# Altium schematic sheet CAN_Tranceiver.SchDoc
size A
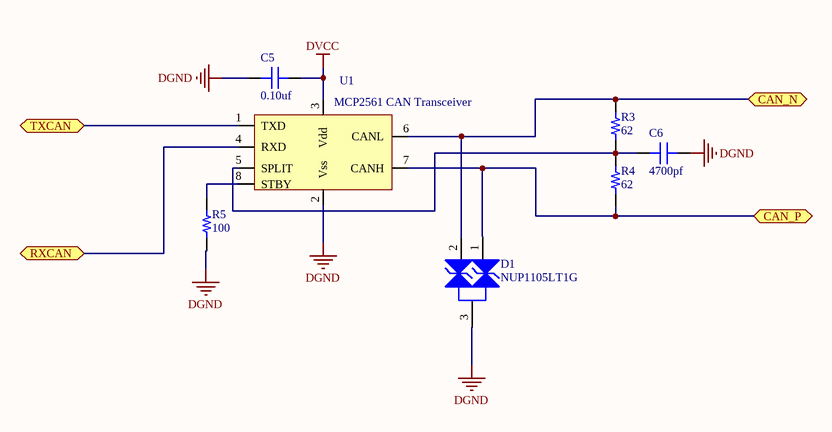
[diagram p0: CAN_Tranceiver.SchDoc]

## Parts
C5  value 0.10uf  [CAP 0603/1608]  (hidden comment: Capacitor MLCC 0.10uf 50V CAP 0603/1608)
C6  value 4700pf  [CAP 0603/1608]  (hidden comment: Capacitor MLCC 4700pf 50V CAP 0603/1608)
D1  NUP1105LT1G  [SOT-23 (TO-236)]
R3  value 62  [RES 0603/1608]  (hidden comment: Resistor 62 0603 1/10W 5%)
R4  value 62  [RES 0603/1608]  (hidden comment: Resistor 62 0603 1/10W 5%)
R5  value 100  [RES 0603/1608]  (hidden comment: Resistor 100 0603 1/10W 10%)
U1  MCP2561 CAN Transceiver  [SOIC-8]

## Ports
CAN_N (bidir), CAN_P (bidir), RXCAN (bidir), TXCAN (bidir)

## Nets
DGND: C5.1 C6.1 D1.3(K) R5.1 U1.2(Vss)
DVCC: C5.2 U1.3(Vdd)
CAN_N: D1.2(K) R3.1 U1.6(CANL) ; port CAN_N
CAN_P: D1.1(K) R4.2 U1.7(CANH) ; port CAN_P
RXCAN: U1.4(RXD) ; port RXCAN
TXCAN: U1.1(TXD) ; port TXCAN
NetC6_2: C6.2 R3.2 R4.1 U1.5(SPLIT)
NetR5_2: R5.2 U1.8(STBY)

## Library data of the parts
C5 = 943: Manufacturer_id: 1; idCapacitor: 943; Name: Cap_0.10uf_50V_CAP 0603/1608; Dielectric: Ceramic; Created_By: Nick Mah; Drawer_id: 1; Voltage_Rating: 50V; Package: CAP 0603/1608; Created_Date: 10/20/2018
C6 = 929: Manufacturer_id: 1; idCapacitor: 929; Name: Cap_4700pf_50V_CAP 0603/1608; Dielectric: Ceramic; Created_By: Nick Mah; Drawer_id: 1; Voltage_Rating: 50V; Package: CAP 0603/1608; Created_Date: 10/20/2018
D1 = 7: ESD Protection Diode; Manufacturer_id: 1; idDiode: 7; Name: SOT-23_350W_Zener; Value: TVS_24V; Type: Zener; Ic: 8A; Power: 350W; Drawer_id: 1; Num_Circuits: 1; Package: SOT-23; MfrPartNo: NUP1105LT1G; Link: https://www.digikey.com/product-detail/en/on-semiconductor/NUP1105LT1G/NUP1105LT1GOSCT-ND/2122067; ComponentLink1URL: https://www.digikey.com/product-detail/en/on-semiconductor/NUP1105LT1G/NUP1105LT1GOSCT-ND/2122067; Supplier1: Digikey; Supplier1PartNo: NUP1105LT1GOSCT-ND
R3 R4 = 1340: Manufacturer_id: 1; idResistor: 1340; Name: Res_62_0603_1/10W_5%; Created_By: Nick Mah; Supplier 1: Digi-Key; Drawer_id: 1; Tolerance: 5%; Power: 1/10W; Package: 0603; ComponentLink1Description: Datasheet; Created_Date: 2018-10-20
R5 = 2293: Manufacturer_id: 1; idResistor: 2293; Name: Res_100_0603_1/10W_10%; Created_By: Nick Mah; Supplier 1: Digi-Key; Drawer_id: 1; Tolerance: 10%; Power: 1/10W; Package: 0603; ComponentLink1Description: Datasheet; Created_Date: 2018-10-20
U1 = 5: Manufacturer_id: 1; idIC_Interface: 5; Value: CAN/UART; Data_Rate: 1Mbps; Vin(Min): 4.5V; Vin(Max): 5.5V; Created_By: Angel Delgado; Drawer_id: 1; Name: CAN Transceiver; Type: Transceiver; Protocol: CAN; Num_Circuits: 1; Package: SOIC-8; MfrPartNo: MCP2561; Link: https://www.digikey.com/product-detail/en/microchip-technology/MCP2561T-E-SN/MCP2561T-E-SNCT-ND/5148846